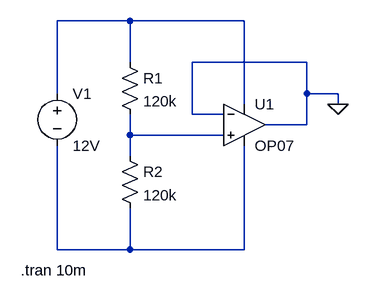
[diagram p0: schematic Power_Supply.asc]
Power_Supply.asc, the LTspice schematic file:
Version 4
SHEET 1 880 680
WIRE -16 0 -128 0
WIRE 160 0 -16 0
WIRE -16 64 -16 0
WIRE 256 64 80 64
WIRE -128 112 -128 0
WIRE 256 112 256 64
WIRE 304 112 256 112
WIRE 160 128 160 0
WIRE 304 128 304 112
WIRE 80 144 80 64
WIRE 128 144 80 144
WIRE 256 160 256 112
WIRE 256 160 192 160
WIRE -16 176 -16 144
WIRE 128 176 -16 176
WIRE -16 208 -16 176
WIRE -128 352 -128 192
WIRE -16 352 -16 288
WIRE -16 352 -128 352
WIRE 160 352 160 192
WIRE 160 352 -16 352
FLAG 304 128 0
SYMBOL voltage -128 96 R0
WINDOW 123 0 0 Left 0
WINDOW 39 0 0 Left 0
SYMATTR InstName V1
SYMATTR Value 12V
SYMBOL res -32 48 R0
SYMATTR InstName R1
SYMATTR Value 120k
SYMBOL res -32 192 R0
SYMATTR InstName R2
SYMATTR Value 120k
SYMBOL OpAmps\\OP07 160 96 R0
SYMATTR InstName U1
TEXT -184 384 Left 2 !.tran 10m

The netlist it stands for:
* Power_Supply.asc
V1 N001 N003 12V
R1 N001 N002 120k
R2 N002 N003 120k
XU1 N002 0 N001 N003 0 LT1001  ; OP07, pins In+ In- V+ V- OUT
.tran 10m
.lib LTC.lib
.backanno
.end